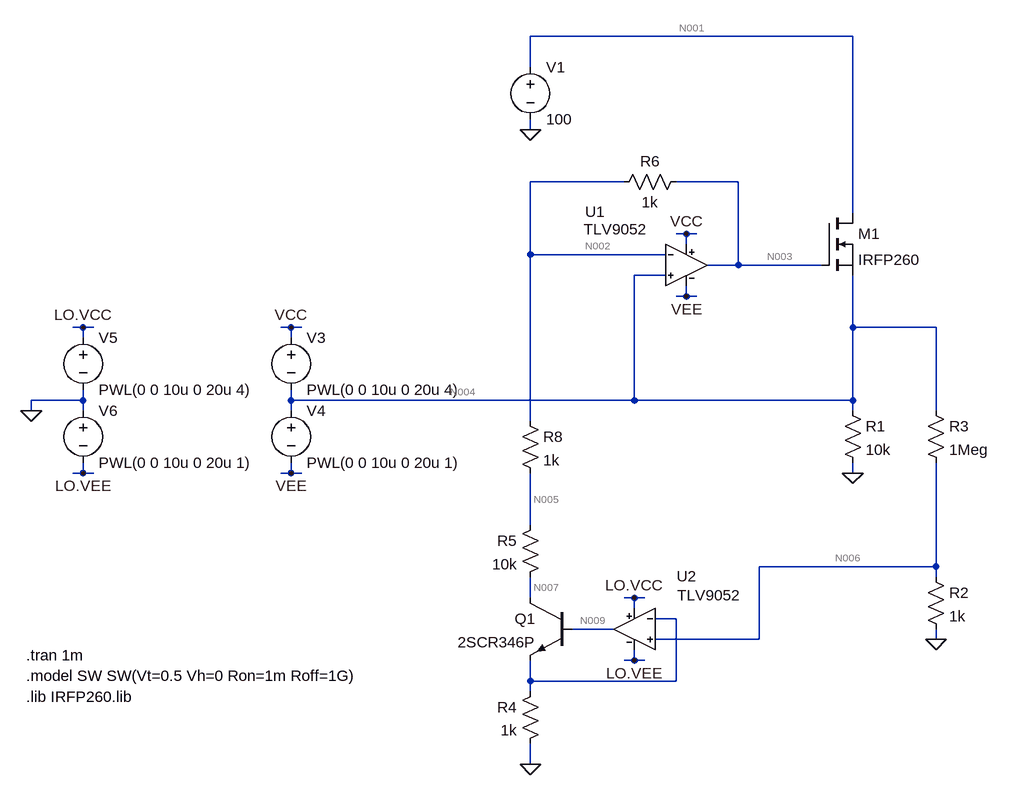
[diagram p0: schematic CV.asc]
CV.asc, the LTspice schematic file:
Version 4
SHEET 1 1156 1300
WIRE -288 -80 -784 -80
WIRE -784 -32 -784 -80
WIRE -784 64 -784 48
WIRE -640 144 -784 144
WIRE -464 144 -560 144
WIRE -288 192 -288 -80
WIRE -544 224 -560 224
WIRE -528 224 -544 224
WIRE -544 240 -544 224
WIRE -784 256 -784 144
WIRE -576 256 -784 256
WIRE -464 272 -464 144
WIRE -464 272 -512 272
WIRE -336 272 -464 272
WIRE -576 288 -624 288
WIRE -544 320 -544 304
WIRE -544 320 -560 320
WIRE -528 320 -544 320
WIRE -1472 368 -1488 368
WIRE -1456 368 -1472 368
WIRE -1152 368 -1168 368
WIRE -1136 368 -1152 368
WIRE -288 368 -288 288
WIRE -160 368 -288 368
WIRE -1472 384 -1472 368
WIRE -1152 384 -1152 368
WIRE -1472 480 -1472 464
WIRE -1472 480 -1552 480
WIRE -1152 480 -1152 464
WIRE -624 480 -624 288
WIRE -624 480 -1152 480
WIRE -288 480 -288 368
WIRE -288 480 -624 480
WIRE -1552 496 -1552 480
WIRE -1472 496 -1472 480
WIRE -1152 496 -1152 480
WIRE -288 496 -288 480
WIRE -160 496 -160 368
WIRE -784 512 -784 256
WIRE -1472 592 -1472 576
WIRE -1472 592 -1488 592
WIRE -1456 592 -1472 592
WIRE -1152 592 -1152 576
WIRE -1152 592 -1168 592
WIRE -1136 592 -1152 592
WIRE -288 592 -288 576
WIRE -784 672 -784 592
WIRE -160 736 -160 576
WIRE -160 736 -432 736
WIRE -160 752 -160 736
WIRE -784 784 -784 752
WIRE -624 784 -640 784
WIRE -608 784 -624 784
WIRE -624 800 -624 784
WIRE -560 816 -592 816
WIRE -656 832 -720 832
WIRE -432 848 -432 736
WIRE -432 848 -592 848
WIRE -160 848 -160 832
WIRE -624 880 -624 864
WIRE -624 880 -640 880
WIRE -608 880 -624 880
WIRE -784 912 -784 880
WIRE -560 912 -560 816
WIRE -560 912 -784 912
WIRE -784 928 -784 912
WIRE -784 1040 -784 1008
FLAG -544 224 VCC
FLAG -544 320 VEE
FLAG -1152 368 VCC
FLAG -1152 592 VEE
FLAG -784 64 0
FLAG -288 592 0
FLAG -160 848 0
FLAG -624 784 LO.VCC
FLAG -624 880 LO.VEE
FLAG -784 1040 0
FLAG -1472 368 LO.VCC
FLAG -1472 592 LO.VEE
FLAG -1552 496 0
SYMBOL nmos -336 192 R0
SYMATTR InstName M1
SYMATTR Value IRFP260
SYMATTR Prefix X
SYMBOL voltage -784 -48 R0
WINDOW 123 0 0 Left 0
WINDOW 39 0 0 Left 0
SYMATTR InstName V1
SYMATTR Value 100
SYMBOL voltage -1152 368 R0
WINDOW 123 0 0 Left 0
WINDOW 39 0 0 Left 0
SYMATTR InstName V3
SYMATTR Value PWL(0 0 10u 0 20u 4)
SYMBOL voltage -1152 480 R0
WINDOW 123 0 0 Left 0
WINDOW 39 0 0 Left 0
SYMATTR InstName V4
SYMATTR Value PWL(0 0 10u 0 20u 1)
SYMBOL TLV9052 -544 272 R0
WINDOW 0 -156 -82 Left 2
WINDOW 38 -158 -55 Left 2
SYMATTR InstName U1
SYMBOL res -304 480 R0
SYMATTR InstName R1
SYMATTR Value 10k
SYMBOL res -176 736 R0
SYMATTR InstName R2
SYMATTR Value 1k
SYMBOL res -176 480 R0
SYMATTR InstName R3
SYMATTR Value 1Meg
SYMBOL TLV9052 -624 832 M0
WINDOW 0 -96 -81 Left 2
WINDOW 38 -164 -52 Left 2
SYMATTR InstName U2
SYMBOL res -768 912 M0
SYMATTR InstName R4
SYMATTR Value 1k
SYMBOL npn -720 784 M0
SYMATTR InstName Q1
SYMATTR Value 2SCR346P
SYMBOL res -768 656 M0
SYMATTR InstName R5
SYMATTR Value 10k
SYMBOL voltage -1472 368 R0
WINDOW 123 0 0 Left 0
WINDOW 39 0 0 Left 0
SYMATTR InstName V5
SYMATTR Value PWL(0 0 10u 0 20u 4)
SYMBOL voltage -1472 480 R0
WINDOW 123 0 0 Left 0
WINDOW 39 0 0 Left 0
SYMATTR InstName V6
SYMATTR Value PWL(0 0 10u 0 20u 1)
SYMBOL res -800 496 R0
SYMATTR InstName R8
SYMATTR Value 1k
SYMBOL res -544 128 R90
WINDOW 0 0 56 VBottom 2
WINDOW 3 32 56 VTop 2
SYMATTR InstName R6
SYMATTR Value 1k
TEXT -1560 904 Left 2 !.model SW SW(Vt=0.5 Vh=0 Ron=1m Roff=1G)
TEXT -1560 872 Left 2 !.tran 1m
TEXT -1560 936 Left 2 !.lib IRFP260.lib

The netlist it stands for:
* CV.asc
XM1 N001 N003 N004 IRFP260  ; pins D G S
V1 N001 0 100
V3 VCC N004 PWL(0 0 10u 0 20u 4)
V4 N004 VEE PWL(0 0 10u 0 20u 1)
XU1 N004 N002 VCC VEE N003 TLV9052  ; pins In+ In- V+ V- OUT
R1 N004 0 10k
R2 N006 0 1k
R3 N004 N006 1Meg
XU2 N006 N008 LO.VCC LO.VEE N009 TLV9052  ; pins In+ In- V+ V- OUT
R4 N008 0 1k
Q1 N007 N009 N008 0 2SCR346P
R5 N005 N007 10k
V5 LO.VCC 0 PWL(0 0 10u 0 20u 4)
V6 0 LO.VEE PWL(0 0 10u 0 20u 1)
R8 N002 N005 1k
R6 N003 N002 1k
.model NPN NPN
.model PNP PNP
.lib standard.bjt
.model SW SW(Vt=0.5 Vh=0 Ron=1m Roff=1G)
.tran 1m
.lib IRFP260.lib
.lib TLV9052.lib
.backanno
.end

* Results of the author's LTspice run, read from the files saved beside the schematic
* Operating Point, zero values left out:
*   V(n004) = 123.6 mV
*   V(n001) = 100 V
*   V(n003) = 124.2 mV
*   V(vcc) = 123.6 mV
*   V(vee) = 123.6 mV
*   V(n002) = 124.2 mV
*   V(n006) = 123.5 µV
*   V(n009) = 1.305 mV
*   V(n007) = 124.2 mV
*   V(n005) = 124.2 mV
*   Ic(Q1) = 117.5 pA
*   Ib(Q1) = -117.4 pA
*   I(R1) = 12.36 µA
*   I(R2) = 123.5 nA
*   I(R3) = 123.5 nA
*   I(R5) = 117.5 pA
*   I(R8) = 117.5 pA
*   I(R6) = 118.5 pA
*   I(V1) = -12.49 µA
*   I(V3) = -330 µA
*   I(V4) = -330 µA
*   I(V5) = -330 µA
*   I(V6) = -330 µA
*   Ix(m1:1) = 12.49 µA
*   Ix(m1:2) = -99.88 pA
*   Ix(m1:3) = -12.48 µA
*   Ix(u1:IN+) = 2 pA
*   Ix(u1:IN-) = 1.003 pA
*   Ix(u1:VCC) = 330 µA
*   Ix(u1:VEE) = -330 µA
*   Ix(u1:OUT) = -18.66 pA
*   Ix(u2:IN+) = 2.001 pA
*   Ix(u2:VCC) = 330 µA
*   Ix(u2:VEE) = -330 µA
*   Ix(u2:OUT) = 117.4 pA
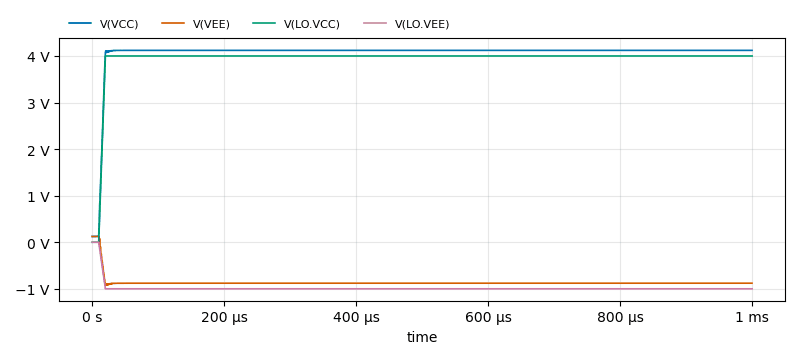
[diagram p1: Transient Analysis of CV.asc, plotted from the saved traces]
* Transient Analysis, 1 run:
*   V(VCC): min 123.6 mV, max 4.121 V, average 4.06 V, rms 4.086 V, last 4.121 V
*   V(VEE): min -923.9 mV, max 138.3 mV, average -864.8 mV, rms 872.4 mV, last -879.5 mV
*   V(LO.VCC): min 0 V, max 4 V, average 3.94 V, rms 3.967 V, last 4 V
*   V(LO.VEE): min -1 V, max 0 V, average -985 mV, rms 991.6 mV, last -1 V